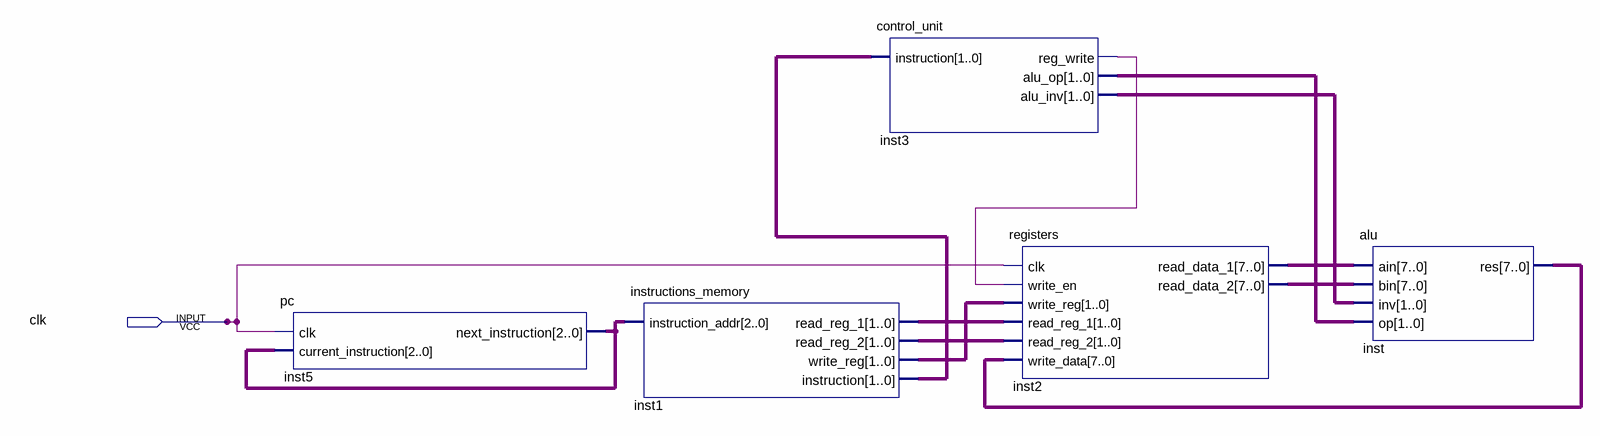
[diagram p0: schematic sheet]
// Quartus schematic easymip8bits.bdf as structural Verilog: 5 symbols, 1 pins
module easymip8bits (
  input  clk
);

  wire inst3_reg_write;
  wire [1:0] inst1_instruction, inst1_read_reg_1, inst1_read_reg_2, inst1_write_reg, inst3_alu_inv,
       inst3_alu_op;
  wire [2:0] inst5_next_instruction;
  wire [7:0] inst2_read_data_1, inst2_read_data_2, inst_res;

  pc inst5 (.clk(clk), .current_instruction(inst5_next_instruction), .next_instruction(inst5_next_instruction));
  instructions_memory inst1 (
    .instruction_addr(inst5_next_instruction), .read_reg_1(inst1_read_reg_1), .read_reg_2(inst1_read_reg_2),
    .write_reg(inst1_write_reg), .instruction(inst1_instruction));
  control_unit inst3 (
    .instruction(inst1_instruction), .reg_write(inst3_reg_write), .alu_op(inst3_alu_op),
    .alu_inv(inst3_alu_inv));
  registers inst2 (
    .clk(clk), .write_en(inst3_reg_write), .write_reg(inst1_write_reg), .read_reg_1(inst1_read_reg_1),
    .read_reg_2(inst1_read_reg_2), .write_data(inst_res), .read_data_1(inst2_read_data_1),
    .read_data_2(inst2_read_data_2));
  alu inst (.ain(inst2_read_data_1), .bin(inst2_read_data_2), .inv(inst3_alu_inv), .op(inst3_alu_op), .res(inst_res));
endmodule
